# EAGLE design mspfacedraft (EAGLE 9.6.2)
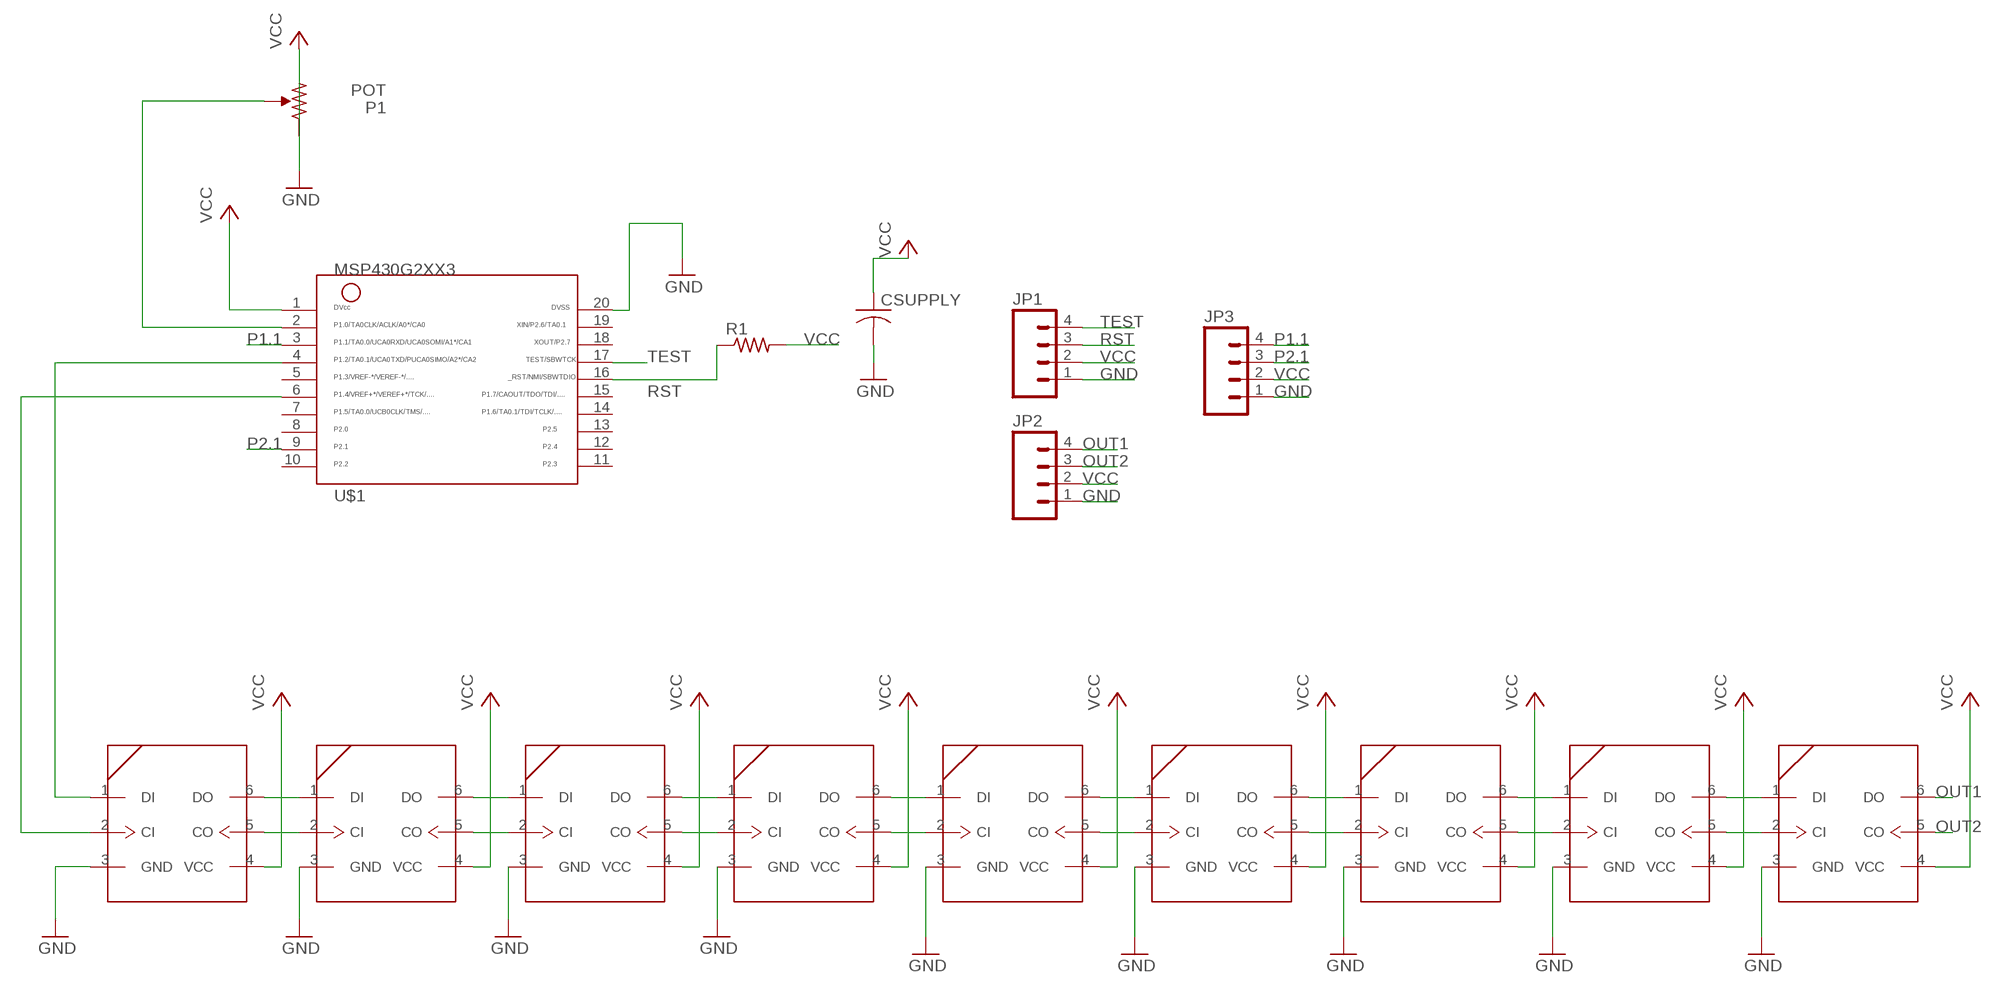
[diagram p0: schematic, sheet 1]

## Parts
CSUPPLY  C-USC1206  [C1206]
JP1  M04LOCK  [1X04_LOCK]
JP2  M04LOCK  [1X04_LOCK]
JP3  M04LOCK  [1X04_LOCK]
LED1  APA102  [5050]
LED2  APA102  [5050]
LED3  APA102  [5050]
LED4  APA102  [5050]
LED5  APA102  [5050]
LED6  APA102  [5050]
LED7  APA102  [5050]
LED8  APA102  [5050]
LED9  APA102  [5050]
P1  POT  [POT]
R1  R-US_R1206  [R1206]
U$1  MSP430G2XX3TSSOP  [PW20]

## Nets
GND: CSUPPLY.2 JP1.1 JP2.1 JP3.1 LED1.3(GND) LED2.3(GND) LED3.3(GND) LED4.3(GND) LED5.3(GND) LED6.3(GND) LED7.3(GND) LED8.3(GND) LED9.3(GND) P1.GND(CW) U$1.20
N$1: LED1.6(DO) LED2.1(DI)
N$2: LED1.5(CO) LED2.2(CI)
N$3: LED2.6(DO) LED3.1(DI)
N$4: LED2.5(CO) LED3.2(CI)
N$5: LED3.6(DO) LED4.1(DI)
N$6: LED3.5(CO) LED4.2(CI)
N$7: LED1.1(DI) U$1.4
N$8: LED1.2(CI) U$1.6
N$9: LED4.6(DO) LED5.1(DI)
N$10: LED4.5(CO) LED5.2(CI)
N$11: LED5.6(DO) LED6.1(DI)
N$12: LED5.5(CO) LED6.2(CI)
N$13: LED6.6(DO) LED7.1(DI)
N$14: LED6.5(CO) LED7.2(CI)
N$15: LED7.6(DO) LED8.1(DI)
N$16: LED7.5(CO) LED8.2(CI)
N$17: LED8.6(DO) LED9.1(DI)
N$18: LED8.5(CO) LED9.2(CI)
N$20: P1.SIG(S) U$1.2
OUT1: JP2.4 LED9.6(DO)
OUT2: JP2.3 LED9.5(CO)
P1.1: JP3.4 U$1.3
P2.1: JP3.3 U$1.9
RST: JP1.3 R1.1 U$1.16
TEST: JP1.4 U$1.17
VCC: CSUPPLY.1 JP1.2 JP2.2 JP3.2 LED1.4(VCC) LED2.4(VCC) LED3.4(VCC) LED4.4(VCC) LED5.4(VCC) LED6.4(VCC) LED7.4(VCC) LED8.4(VCC) LED9.4(VCC) P1.VDD(CCW) R1.2 U$1.1
Unconnected: U$1.5 U$1.7 U$1.8 U$1.10 U$1.11 U$1.12 U$1.13 U$1.14 U$1.15 U$1.18 U$1.19

## Library data of the parts
CSUPPLY = rcl:C-US: CAPACITOR, American symbol
JP1-JP3 = SparkFun:M04: Header 4 Standard 4-pin 0.1" header. Use with straight break away headers (SKU : PRT-00116), right angle break away headers (PRT-00553), swiss pins (PRT-00743), machine pins (PRT-00117), and female headers (PRT-00115). Molex polarized connector foot print use with SKU : PRT-08231 with associated crimp pins and housings. 1MM SMD Version SKU: PRT-10208
LED1-LED9 = ELEC327:APA102: APA102 SPI RGB LED APA102 is a chainable RGB LED. The control protocol is a variant of SPI.
P1 = pot:POT
R1 = resistor:R-US_: RESISTOR, American symbol
U$1 = ELEC327:MSP430G2XX3: MSP430G2XX3 PDIP (N) 20 Pin Package

## Board
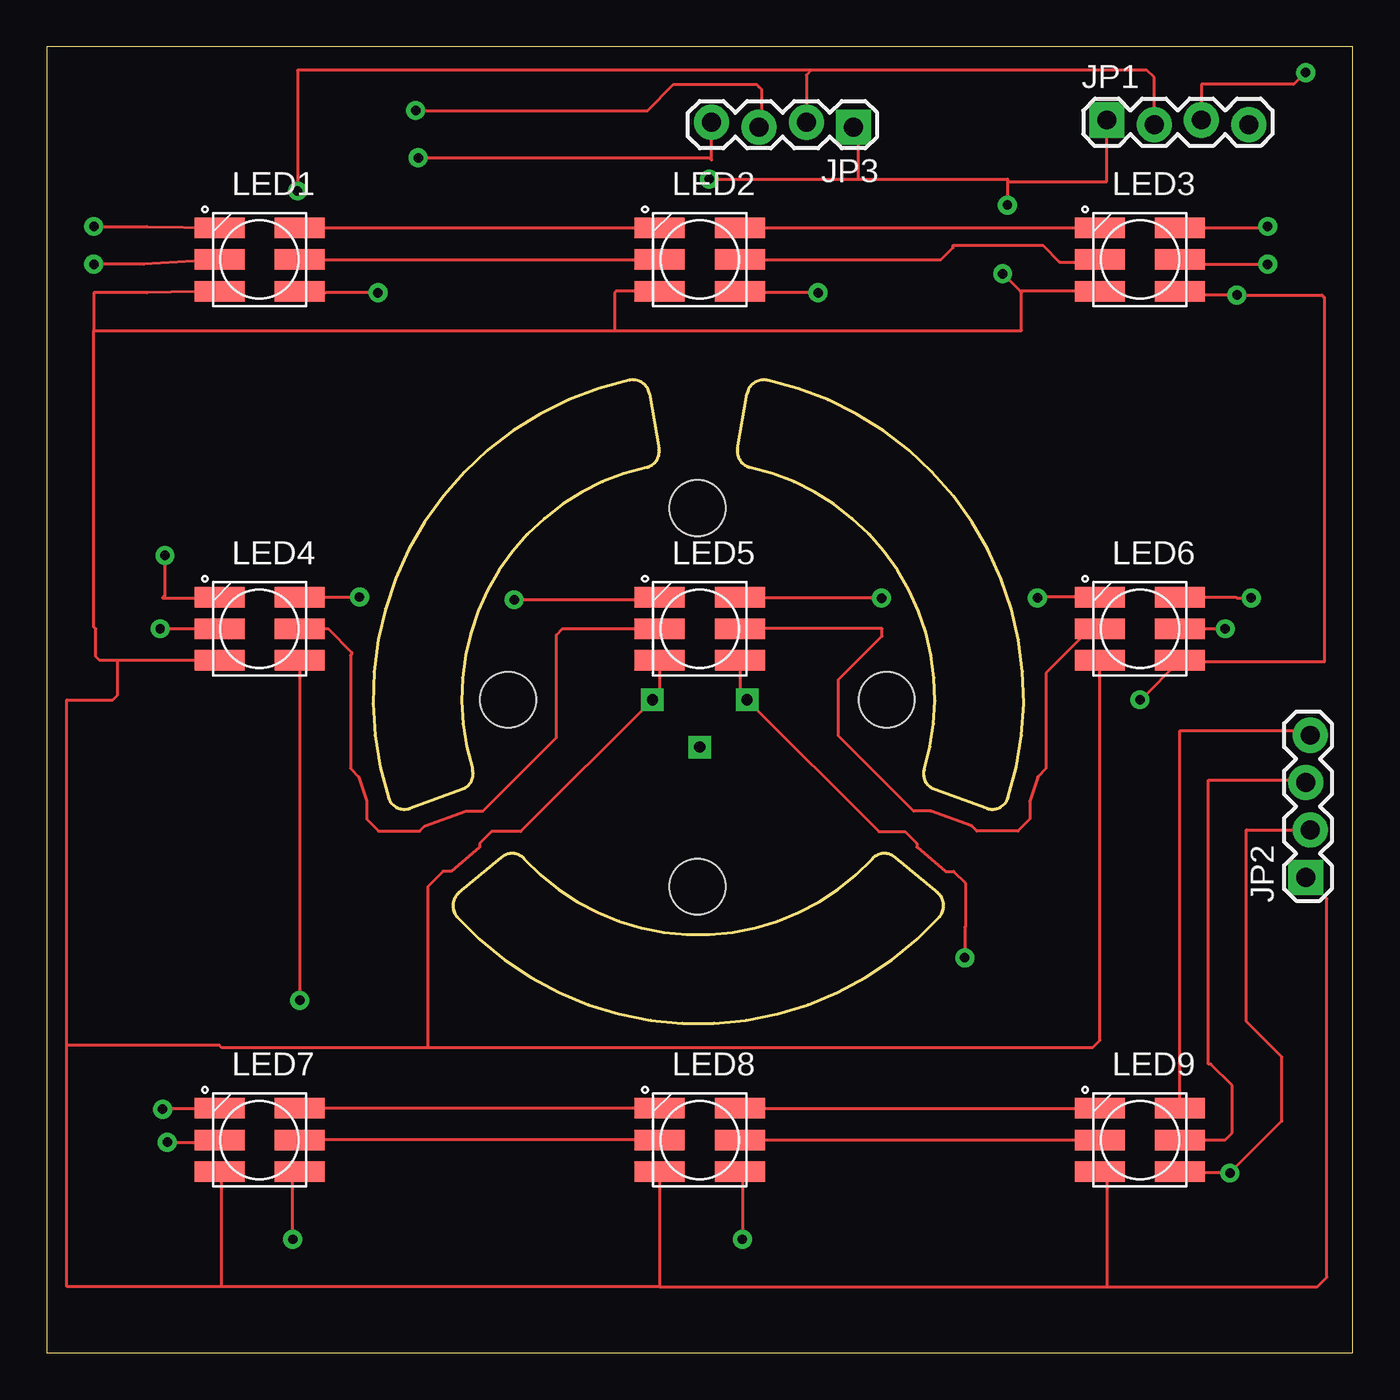
[diagram p1: board, top side]
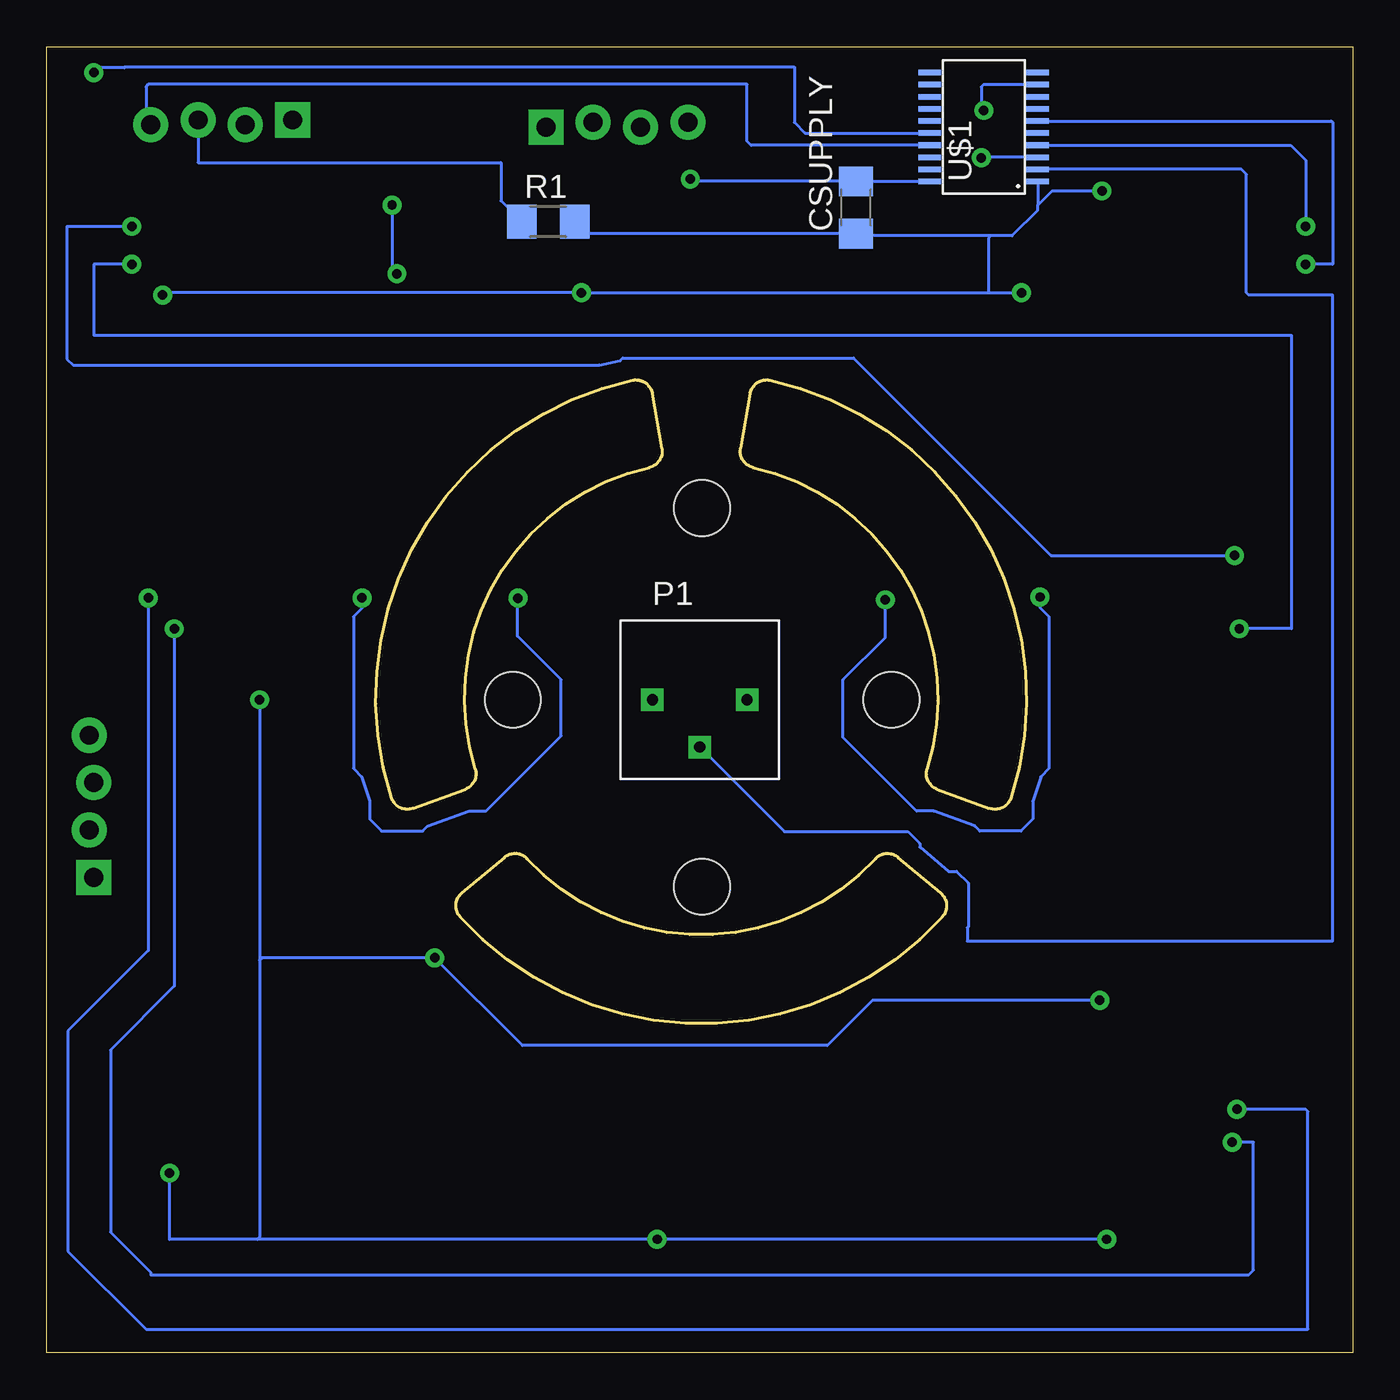
[diagram p2: board, bottom side, seen from below]

Size 70.1 x 70.1 mm. Coordinates in mm from the lower left corner, seen from the top.
Outline: 0,0 70.1,0 70.1,70.1 0,70.1 0,0
Outline: 50.45,29.23 arc92 51.6,29.79 arc96 38.66,52.2 arc92 37.6,51.48 37.08,48.54 arc87 37.76,47.52 arc-95 47.1,31.35 arc87 47.64,30.25 50.45,29.23
Outline: 32.35,51.48 arc92 31.28,52.2 arc96 18.35,29.79 arc92 19.5,29.23 22.3,30.25 arc87 22.85,31.35 arc-95 32.19,47.52 arc87 32.87,48.54 32.35,51.48
Outline: 22.12,24.68 arc92 22.04,23.4 arc96 47.91,23.4 arc92 47.82,24.68 45.53,26.6 arc87 44.31,26.52 arc-95 25.64,26.52 arc87 24.41,26.6 22.12,24.68
Copper layers (1*16): Top 0.035mm / dielectric 1.5mm / Bottom 0.035mm
Design rules "AdvancedCircuitsBarebones": minimum track width 6mil, minimum drill 20mil, track to track 6mil, track to pad 6mil, pad to pad 6mil, via to via 6mil, smd to smd 6mil, copper to edge 10mil, drill to drill 6mil, minimum pad ring 12mil, minimum via ring 10mil, stop-mask expansion 4mil, vias tented up to drill 25mil, thermal gap 10mil
Holes 3 mm at 34.92,25.02 24.77,35.05 34.92,45.34 45.09,35.05

### Footprints (pad centres in the part's own frame; a part is rotated, then mirrored left to right if it is on the bottom)
C1206 = smd 1.6 x 1.8: 1 -1.4,0; 2 1.4,0
1X04_LOCK = drill 1.016 pad 1.88 square: 1 0,0.127 | drill 1.016 pad 1.88: 2 2.54,-0.127; 3 5.08,0.127; 4 7.62,-0.127
5050 = smd 2.68 x 1.1: 1 -2.15,1.7; 2 -2.15,0; 3 -2.15,-1.7; 4 2.15,-1.7; 5 2.15,0; 6 2.15,1.7
POT = drill 0.6 square: GND 2.54,0; SIG 0,-2.54; VDD -2.54,0
R1206 = smd 1.6 x 1.803: 1 -1.422,0; 2 1.422,0
PW20 = smd 0.3 x 1.2: 1 -2.925,-2.9; 2 -2.275,-2.9; 3 -1.625,-2.9; 4 -0.975,-2.9; 5 -0.325,-2.9; 6 0.325,-2.9; 7 0.975,-2.9; 8 1.625,-2.9; 9 2.275,-2.9; 10 2.925,-2.9; 11 2.925,2.9; 12 2.275,2.9; 13 1.625,2.9; 14 0.975,2.9; 15 0.325,2.9; 16 -0.325,2.9; 17 -0.975,2.9; 18 -1.625,2.9; 19 -2.275,2.9; 20 -2.925,2.9

### Placement (x,y rotation side)
CSUPPLY  26.67,61.47 90 bottom
JP1  56.9,66.04 0 top
JP2  67.69,25.53 90 top
JP3  43.31,65.91 180 top
LED1  11.43,58.67 0 top
LED2  35.05,58.67 0 top
LED3  58.67,58.67 0 top
LED4  11.43,38.86 0 top
LED5  35.05,38.86 0 top
LED6  58.67,38.86 0 top
LED7  11.43,11.43 0 top
LED8  35.05,11.43 0 top
LED9  58.67,11.43 0 top
P1  35.05,35.05 0 bottom
R1  43.18,60.71 0 bottom
U$1  19.81,65.79 90 bottom

### Tracks (layer width: path | path; a pad name or v marks a point on that pad's centre or on a via)
GND  (via drill 0.51)
  Top 0.152: LED1.3 5.39,56.9 2.54,56.9 2.54,54.86 | LED3.3 52.25,56.97 | 52.25,56.97 v51.31,57.91 | 52.25,56.97 52.32,56.9 52.32,54.86 30.48,54.86 | 2.54,54.86 30.48,54.86 | 32.89,3.56 9.4,3.56 | 9.4,3.56 1.09,3.56 1.09,16.51 | 1.09,16.51 1.09,35.05 3.56,35.05 3.81,35.31 3.81,37.16 | LED2.3 30.56,56.97 30.48,56.9 30.48,54.86 | 9.4,3.56 9.4,9.61 LED7.3 | LED8.3 32.9,3.56 32.89,3.56 | 56.9,3.56 56.9,9.36 LED9.3 | LED4.3 3.81,37.16 | 3.81,37.16 2.84,37.16 2.64,37.37 2.64,38.86 2.54,38.96 2.54,54.86 | LED5.3 32.9,35.44 P1.GND 25.44,27.98 23.88,27.98 23.24,27.34 23.24,27.14 21.7,25.85 21.28,25.85 20.45,25.02 20.45,16.38 | 32.89,3.56 56.9,3.56 | 56.9,3.56 68.2,3.56 68.71,4.06 68.71,24.38 JP2.1 | 20.45,16.38 56.13,16.38 56.52,16.77 LED6.3 | 20.45,16.38 9.4,16.38 9.27,16.51 1.09,16.51 | v35.56,62.99 43.56,62.99 | 43.56,62.99 51.56,62.99 51.56,62.87 | 51.56,62.87 v51.56,61.59 | 51.56,62.87 56.9,62.87 JP1.1 | 43.56,62.99 43.56,65.53 JP3.1
  Bottom 0.152: v35.56,62.99 35.43,62.86 35.42,62.87 CSUPPLY.2 U$1.20 | v51.56,61.59 51.56,58.17 v51.31,57.91
N$1
  Top 0.152: LED1.6 LED2.1
N$2
  Top 0.152: LED1.5 LED2.2
N$3
  Top 0.152: LED2.6 LED3.1
N$4
  Top 0.152: LED2.5 48.01,58.67 48.64,59.31 48.64,59.44 53.47,59.44 54.36,58.55 56.4,58.55 LED3.2
N$5  (via drill 0.51)
  Top 0.152: LED3.6 65.45,60.37 v65.53,60.45 | v6.35,42.8 6.35,40.64 6.22,40.51 9.23,40.51 LED4.1
  Bottom 0.152: v65.53,60.45 69.01,60.45 69.01,53.34 68.68,53.01 40.43,53.01 39.33,53.25 39.19,53.39 26.79,53.39 16.2,42.8 v6.35,42.8
N$6  (via drill 0.51)
  Top 0.152: LED3.5 61.08,58.42 v65.53,58.42 | v6.1,38.86 LED4.2 | LED4.2 9.4,38.86 9.91,38.35 9.79,38.35 LED4.2
  Bottom 0.152: v65.53,58.42 67.56,58.42 67.56,54.61 3.3,54.61 3.3,38.86 v6.1,38.86
N$7  (via drill 0.51)
  Top 0.152: v2.54,60.45 5.39,60.45 LED1.1
  Bottom 0.152: U$1.4 3.34,64.81 2.54,64.01 v2.54,60.45
N$8  (via drill 0.51)
  Top 0.152: LED1.2 5.22,58.42 v2.54,58.42
  Bottom 0.152: U$1.6 1.16,66.11 1.09,66.04 1.09,58.42 v2.54,58.42
N$9  (via drill 0.51)
  Top 0.152: LED4.6 v16.79,40.56 | v25.09,40.42 32.76,40.42 LED5.1
  Bottom 0.152: v16.79,40.56 16.79,40 16.31,39.52 16.31,31.36 16.76,30.92 17.18,29.61 17.18,28.65 17.82,28.01 20.03,28.01 20.3,28.27 22.51,29.08 23.42,29.08 27.36,33.02 27.36,36.13 25.09,38.39 v25.09,40.42
N$10
  Top 0.152: LED4.5 15.11,38.86 16.38,37.59 16.38,37.5 16.31,37.43 16.31,31.36 16.76,30.92 17.18,29.61 17.18,28.65 17.82,28.01 20.03,28.01 20.3,28.27 22.51,29.08 23.42,29.08 27.36,33.02 27.36,38.53 27.69,38.86 LED5.2
N$11  (via drill 0.51)
  Top 0.152: LED6.1 53.22,40.56 v53.17,40.51 | v44.81,40.5 37.26,40.5 LED5.6
  Bottom 0.152: v53.17,40.51 53.17,39.98 53.63,39.52 53.63,31.36 53.19,30.92 52.77,29.61 52.77,28.65 52.13,28.01 49.92,28.01 49.65,28.27 47.44,29.08 46.53,29.08 42.49,33.12 42.49,36.13 44.83,38.46 44.83,40.51 44.82,40.51 v44.81,40.5
N$12
  Top 0.152: LED6.2 56.01,38.86 53.63,36.49 53.63,31.36 53.19,30.92 52.77,29.61 52.77,28.65 52.13,28.01 49.92,28.01 49.65,28.27 47.44,29.08 46.53,29.08 42.49,33.12 42.49,36.13 44.83,38.46 44.83,38.86 LED5.5
N$13  (via drill 0.51)
  Top 0.152: LED6.6 63.83,40.56 63.88,40.51 v64.64,40.51 | v6.22,13.08 6.27,13.13 LED7.1
  Bottom 0.152: v6.22,13.08 2.54,13.08 2.41,12.95 2.41,1.27 64.77,1.27 68.96,5.46 68.96,17.27 64.64,21.59 v64.64,40.51
N$14  (via drill 0.51)
  Top 0.152: v6.48,11.3 9.15,11.3 LED7.2 | LED6.5 v63.25,38.86
  Bottom 0.152: v6.48,11.3 5.33,11.3 5.33,4.45 5.59,4.19 64.52,4.19 64.52,4.32 66.67,6.48 66.67,16.26 63.25,19.68 v63.25,38.86
N$15
  Top 0.152: LED8.1 LED7.6
N$16
  Top 0.152: LED8.2 LED7.5
N$17
  Top 0.152: LED8.6 LED9.1
N$18
  Top 0.152: LED8.5 LED9.2
N$20
  Bottom 0.152: P1.SIG 30.52,27.98 23.88,27.98 23.24,27.34 23.24,27.14 21.7,25.85 21.28,25.85 20.64,25.21 20.64,22.87 20.7,22.81 20.7,22.1 1.09,22.1 1.09,56.77 5.59,56.77 5.71,56.9 5.71,63.25 5.98,63.51 U$1.2
OUT1
  Top 0.152: LED9.6 60.82,33.39 60.83,33.4 66.93,33.4 67.31,33.02 67.69,33.02 JP2.4
OUT2
  Top 0.152: LED9.5 63.25,11.43 63.63,11.81 63.63,14.35 62.48,15.49 62.36,15.49 62.36,30.73 68.07,30.73 67.94,30.61 JP2.3
P1.1  (via drill 0.51)
  Top 0.152: v19.94,64.14 35.56,64.14 35.69,64.01 JP3.4
  Bottom 0.152: U$1.3 19.91,64.16 v19.94,64.14
P2.1  (via drill 0.51)
  Top 0.152: JP3.3 38.35,65.91 38.35,67.82 38.23,67.94 38.1,68.07 33.66,68.07 32.26,66.67 v19.81,66.67
  Bottom 0.152: U$1.9 19.82,68.06 19.94,67.94 19.94,66.8 v19.81,66.67
RST  (via drill 0.51)
  Top 0.152: v67.56,68.71 66.93,68.07 61.98,68.07 JP1.3
  Bottom 0.152: U$1.16 29.39,65.46 29.97,66.04 29.97,69.01 65.91,69.01 65.91,68.96 67.31,68.96 v67.56,68.71 | R1.1 45.72,61.82 45.72,63.88 61.98,63.88 JP1.3
TEST
  Bottom 0.152: U$1.17 32.3,64.81 32.51,65.02 32.51,68.07 64.64,68.07 64.77,67.94 64.77,66.17 JP1.4
VCC  (via drill 0.51)
  Top 0.152: LED3.4 60.87,56.93 61.43,56.93 61.59,56.77 v63.88,56.77 68.45,56.77 68.58,56.64 68.58,37.08 60.9,37.08 LED6.4 58.71,35.05 v58.67,35.05 | v13.21,6.1 13.21,9.36 LED7.4 | LED8.4 37.34,9.59 v37.34,6.1 | JP2.2 64.39,28.07 64.39,17.78 66.29,15.88 66.29,12.45 v63.5,9.65 60.9,9.65 LED9.4 | LED5.4 37.2,35.44 P1.VDD 44.67,27.98 46.06,27.98 46.7,27.34 46.7,27.14 48.25,25.85 48.67,25.85 49.31,25.21 49.31,22.87 49.28,22.84 v49.28,21.21 | JP1.2 59.44,68.45 59.05,68.83 41.02,68.83 | 41.02,68.83 13.46,68.83 v13.46,62.36 | LED4.4 13.58,18.93 v13.59,18.92 | 41.02,68.83 40.77,68.58 JP3.2 | v41.4,56.9 37.28,56.9 LED2.4 | v17.78,56.9 14.99,56.9 13.54,56.9 13.54,56.93 LED1.4
  Bottom 0.152: 16.91,61.59 16.91,61.32 18.29,59.94 19.43,59.94 | 19.43,59.94 26.55,59.94 CSUPPLY.1 41.12,60.07 R1.2 | 19.56,56.9 v41.4,56.9 63.75,56.9 v63.88,56.77 | v13.21,6.1 v37.34,6.1 58.8,6.1 | 58.8,6.1 63.5,6.1 v63.5,9.65 | v58.67,35.05 58.67,21.08 | 58.67,21.08 58.67,6.22 58.8,6.1 | 58.67,21.08 58.55,21.21 v49.28,21.21 44.57,16.5 28.2,16.5 25.78,18.92 v13.59,18.92 | v13.46,62.36 16.15,62.36 16.91,61.59 | U$1.1 16.91,61.59 | 19.43,59.94 19.56,59.82 19.56,56.9 | 19.56,56.9 v17.78,56.9

### Text on the board
Document: RUBIKS TEAM